# Altium schematic sheet housing_interconnect.schdoc: Housing Interconnect Board
size 431 x 279 mm; DrawnBy: D. Bruey, M. Ciuffo; Organization: Synapse Product Development, LLC.; Address1: 1511 6th Ave., Suite 400; Address2: Seattle, Washington 98101; Address3: 206.381.0898; Address4: www.synapse.com; DocumentNumber: 1; SheetNumber: 1; SheetTotal: 2; PageSetup: Record=PageOptions|CenterHorizontal=True|CenterVertical=True|PrintScale=1.06|XCorrection=1.00|YCorrection=1.00|PrintKind=1|BorderSize=5000000|LeftOffset=0|BottomOffset=0|Orientation=2|PaperLength=4318|PaperWidth=2794|Scale=100|PaperSource=7|PrintQuality=200|MediaType=1|DitherType=10|PrintScaleMode=1|PaperKind=11x17|PaperIndex=3
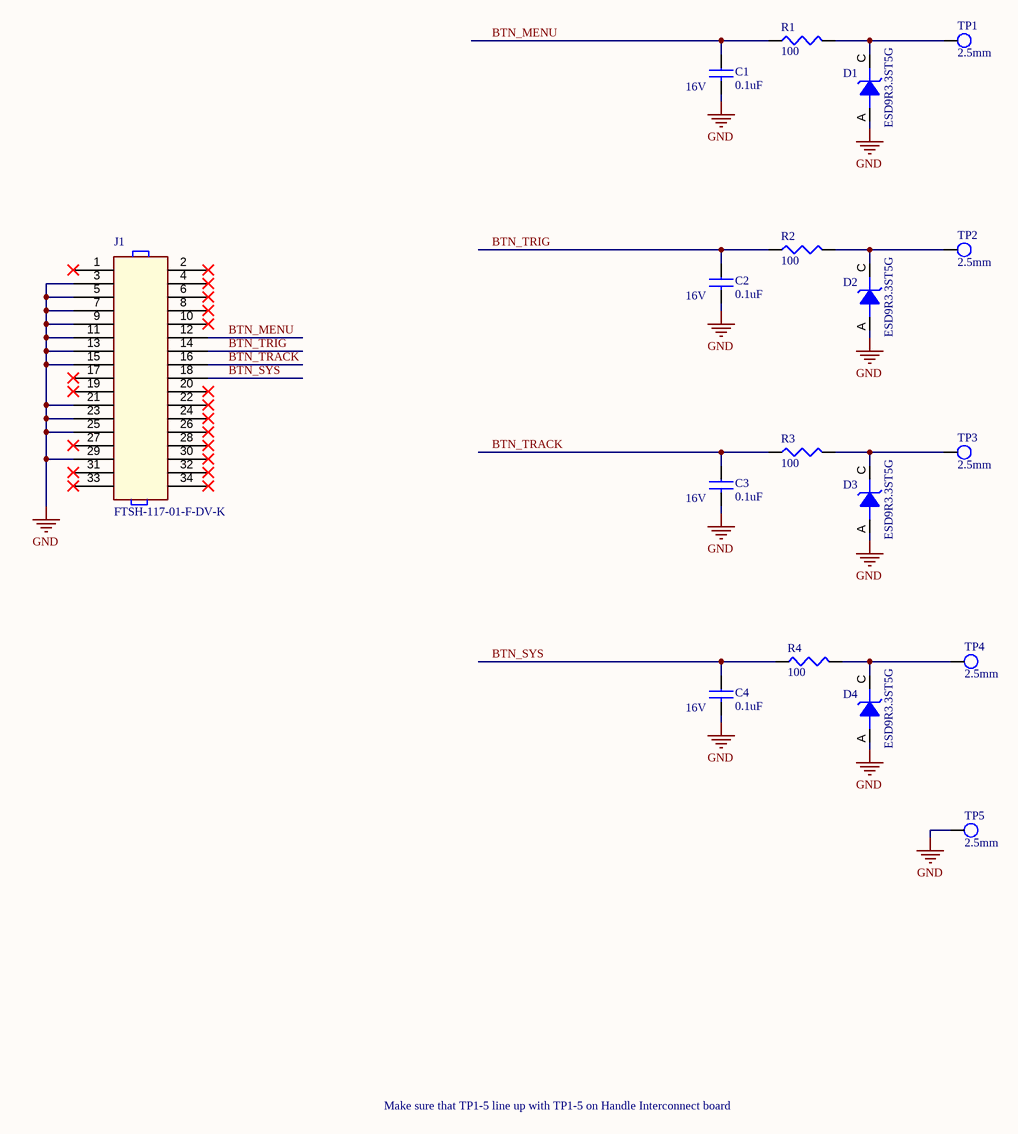
[diagram p0: housing_interconnect.schdoc]

## Parts
C1  0.1uF  Voltage: 16V  [0402-IPCsm_55]
C2  0.1uF  Voltage: 16V  [0402-IPCsm_55]
C3  0.1uF  Voltage: 16V  [0402-IPCsm_55]
C4  0.1uF  Voltage: 16V  [0402-IPCsm_55]
D1  ESD9R3.3ST5G  [sod923-40]
D2  ESD9R3.3ST5G  [sod923-40]
D3  ESD9R3.3ST5G  [sod923-40]
D4  ESD9R3.3ST5G  [sod923-40]
J1  FTSH-117-01-F-DV-K  [FTSH-117-01-XXX-DV-K]
R1  100  [0402-IPCsm_40]
R2  100  [0402-IPCsm_40]
R3  100  [0402-IPCsm_40]
R4  100  [0402-IPCsm_40]
TP1  2.5mm  [TPC250SMT]  (no BOM)
TP2  2.5mm  [TPC250SMT]  (no BOM)
TP3  2.5mm  [TPC250SMT]  (no BOM)
TP4  2.5mm  [TPC250SMT]  (no BOM)
TP5  2.5mm  [TPC250SMT]  (no BOM)

## Nets
GND: C1.2 C2.2 C3.2 C4.2 D1.A D2.A D3.A D4.A J1.3 J1.5 J1.7 J1.9 J1.11 J1.13 J1.15 J1.21 J1.23 J1.25 J1.29 TP5.1(TP)
BTN_MENU: C1.1 J1.12 R1.1
BTN_SYS: C4.1 J1.18 R4.1
BTN_TRACK: C3.1 J1.16 R3.1
BTN_TRIG: C2.1 J1.14 R2.1
NetD1_C: D1.C R1.2 TP1.1(TP)
NetD2_C: D2.C R2.2 TP2.1(TP)
NetD3_C: D3.C R3.2 TP3.1(TP)
NetD4_C: D4.C R4.2 TP4.1(TP)

Not connected (* = marked no-connect by the designer): J1 1* 2* 4* 6* 8* 10* 17* 19* 20* 22* 24* 26* 27* 28* 30* 31* 32* 33* 34*

## Notes on the sheet
- Make sure that TP1-5 line up with TP1-5 on Handle Interconnect board
- Design Notes:
- Layout Notes:
- Project:
- Sheet Title:
- PCBA:
- PROPRIETARY AND CONFIDENTIAL
- Drawn by:
- Schematic Part Number:
- Schematic Revision:
- Date:
- Sheet:
- /

## Library data of the parts
C1-C4 = GRM155R71C104KA88D: CAP CER .1UF 16V X7R 0402; part_type: capacitor; id: 588; mfg: MURATA; dist: DIGIKEY; dist_pn: 490-3261-1-ND; source_package: C_0P1U_16V_X7R_0402; tolerance: 10%; TableName: viewAltiumCapacitors; mfg_pn: GRM155R71C104KA88D; type: X7R; height: 0.55MM; status: Unknown
D1-D4 = ESD9R3.3ST5G: TVS DIODE 3.3VWM 7.8VC SOD923; id: 1102; mfg: On Semiconductor; dist: Digikey; dist_pn: ESD9R3.3ST5GOSCT-ND; voltage: 3.3V; TableName: viewAltiumDiscretes; mfg_pn: ESD9R3.3ST5G; part_type: tvs; type: TVS; status: Unknown; height: 0.4mm
J1 = FTSH-117-01-f-DV-k: 34 Positions Header, Shrouded Connector 0.050" (1.27mm) Surface Mount Gold; id: 1653; mfg: Samtec; dist: Digikey; dist_pn: SAM8912-ND; positions: 34; TableName: viewAltiumConnectors; mfg_pn: FTSH-117-01-F-DV-K; part_type: connector; height: 5.97mm; status: Unknown
R1-R4 = MCR01MZPJ101: RES 100 OHM 5% 0402 SMD; part_type: resistor; Tolerance: 5.00%; DIST: DIGIKEY; MFG: ROHM; DIST_PN: RHM100JCT-ND; id: 1182; source_package: R_ 100_5P_0402; TableName: viewAltiumResistors; Height: 0.4MM; MFG_PN: MCR01MZPJ101; status: Unknown
TP1-TP5 = TPC250SMT: TEST POINT, SMT, 2.50mm; part_type: test_point; id: 1241; mfg: NA; TableName: viewAltiumMisc; mfg_pn: TPC250SMT; dist: NA; dist_pn: NA; status: Unknown